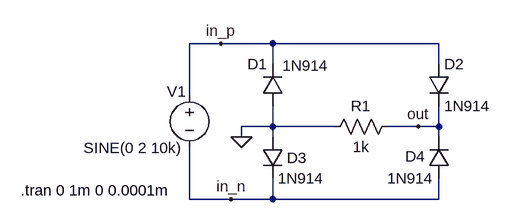
[diagram p0: schematic full_wave_rectifier.asc]
full_wave_rectifier.asc, the LTspice schematic file:
Version 4
SHEET 1 880 680
WIRE 80 64 32 64
WIRE 160 64 80 64
WIRE 416 64 160 64
WIRE 160 96 160 64
WIRE 416 96 416 64
WIRE 32 144 32 64
WIRE 160 192 160 160
WIRE 160 192 112 192
WIRE 256 192 160 192
WIRE 384 192 336 192
WIRE 416 192 416 160
WIRE 416 192 384 192
WIRE 112 208 112 192
WIRE 160 208 160 192
WIRE 416 208 416 192
WIRE 32 304 32 224
WIRE 96 304 32 304
WIRE 160 304 160 272
WIRE 160 304 96 304
WIRE 416 304 416 272
WIRE 416 304 160 304
FLAG 112 208 0
FLAG 384 192 out
FLAG 80 64 in_p
FLAG 96 304 in_n
SYMBOL diode 176 160 R180
WINDOW 0 24 64 Left 2
WINDOW 3 -70 62 Left 2
SYMATTR InstName D1
SYMATTR Value 1N914
SYMBOL diode 400 96 R0
SYMATTR InstName D2
SYMATTR Value 1N914
SYMBOL diode 144 208 R0
WINDOW 0 38 32 Left 2
SYMATTR InstName D3
SYMATTR Value 1N914
SYMBOL diode 432 272 R180
WINDOW 0 37 34 Left 2
WINDOW 3 24 0 Left 2
SYMATTR InstName D4
SYMATTR Value 1N914
SYMBOL voltage 32 128 R0
WINDOW 0 -35 10 Left 2
WINDOW 3 -163 97 Left 2
WINDOW 123 0 0 Left 0
WINDOW 39 0 0 Left 0
SYMATTR InstName V1
SYMATTR Value SINE(0 2 10k)
SYMBOL res 352 176 R90
WINDOW 0 0 56 VBottom 2
WINDOW 3 32 56 VTop 2
SYMATTR InstName R1
SYMATTR Value 1k
TEXT -228 290 Left 2 !.tran 0 1m 0 0.0001m

The netlist it stands for:
* full_wave_rectifier.asc
D1 0 in_p 1N914
D2 in_p out 1N914
D3 0 in_n 1N914
D4 in_n out 1N914
V1 in_p in_n SINE(0 2 10k)
R1 out 0 1k
.model D D
.lib standard.dio
.tran 0 1m 0 0.0001m
.backanno
.end